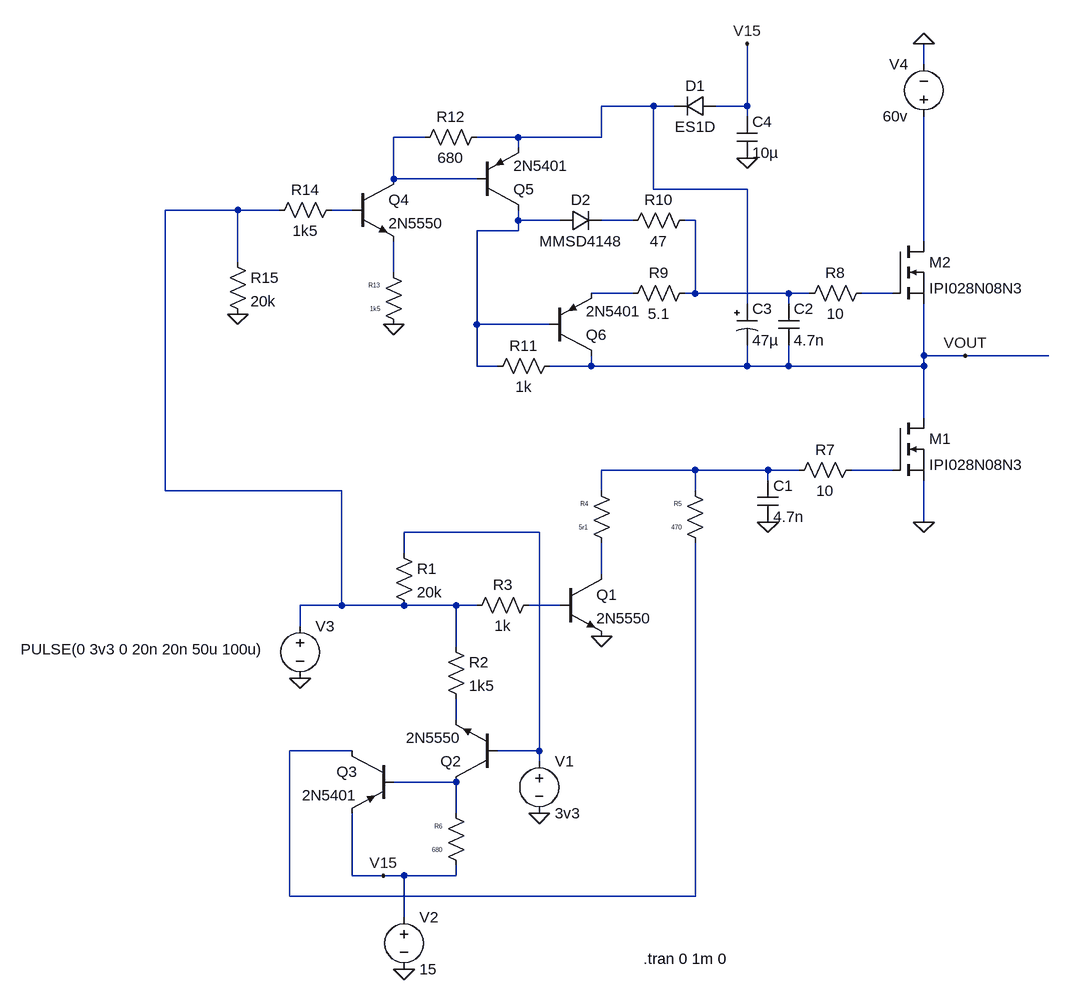
[diagram p0: schematic Motor Controller Gate Driver Linear.asc]
Motor Controller Gate Driver Linear.asc, the LTspice schematic file:
Version 4
SHEET 1 1140 832
WIRE 944 -576 944 -608
WIRE 528 -512 448 -512
WIRE 560 -512 528 -512
WIRE 672 -512 672 -608
WIRE 672 -512 624 -512
WIRE 672 -496 672 -512
WIRE 176 -464 128 -464
WIRE 320 -464 256 -464
WIRE 448 -464 448 -512
WIRE 448 -464 320 -464
WIRE 320 -448 320 -464
WIRE 128 -400 128 -464
WIRE 256 -400 128 -400
WIRE 528 -384 528 -512
WIRE 672 -384 528 -384
WIRE -112 -352 -224 -352
WIRE -48 -352 -112 -352
WIRE 64 -352 32 -352
WIRE 320 -336 320 -352
WIRE 384 -336 320 -336
WIRE 496 -336 448 -336
WIRE 592 -336 576 -336
WIRE 320 -320 320 -336
WIRE 320 -320 256 -320
WIRE 944 -304 944 -496
WIRE -112 -272 -112 -352
WIRE 128 -256 128 -304
WIRE 496 -224 432 -224
WIRE 592 -224 592 -336
WIRE 592 -224 576 -224
WIRE 736 -224 592 -224
WIRE 768 -224 736 -224
WIRE 896 -224 848 -224
WIRE 672 -208 672 -384
WIRE 736 -208 736 -224
WIRE 256 -176 256 -320
WIRE 368 -176 256 -176
WIRE 944 -128 944 -208
WIRE 1008 -128 944 -128
WIRE 1136 -128 1008 -128
WIRE 256 -112 256 -176
WIRE 288 -112 256 -112
WIRE 432 -112 432 -128
WIRE 432 -112 368 -112
WIRE 672 -112 672 -144
WIRE 672 -112 432 -112
WIRE 736 -112 736 -144
WIRE 736 -112 672 -112
WIRE 944 -112 944 -128
WIRE 944 -112 736 -112
WIRE 944 -32 944 -112
WIRE 592 48 448 48
WIRE 704 48 592 48
WIRE 752 48 704 48
WIRE 896 48 832 48
WIRE 704 64 704 48
WIRE -224 80 -224 -352
WIRE 48 80 -224 80
WIRE 448 80 448 48
WIRE 592 80 592 48
WIRE 944 128 944 64
WIRE 352 144 144 144
WIRE 144 176 144 144
WIRE 448 208 448 160
WIRE 48 256 48 80
WIRE 48 256 -16 256
WIRE 144 256 48 256
WIRE 224 256 144 256
WIRE 256 256 224 256
WIRE 384 256 336 256
WIRE -16 288 -16 256
WIRE 224 320 224 256
WIRE 224 432 224 400
WIRE 64 480 -32 480
WIRE 352 480 352 144
WIRE 352 480 288 480
WIRE 352 496 352 480
WIRE 224 528 128 528
WIRE 224 576 224 528
WIRE 64 672 64 576
WIRE 112 672 64 672
WIRE 144 672 112 672
WIRE 224 672 224 656
WIRE 224 672 144 672
WIRE -32 704 -32 480
WIRE 592 704 592 160
WIRE 592 704 -32 704
WIRE 144 736 144 672
FLAG 448 304 0
FLAG 352 576 0
FLAG 144 816 0
FLAG -16 368 0
FLAG 704 128 0
FLAG 944 128 0
FLAG 944 -608 0
FLAG -112 -192 0
FLAG 128 -176 0
FLAG 672 -432 0
FLAG 1008 -128 VOUT
FLAG 112 672 V15
FLAG 672 -608 V15
SYMBOL res 128 160 R0
SYMATTR InstName R1
SYMATTR Value 20k
SYMBOL res 208 304 R0
SYMATTR InstName R2
SYMATTR Value 1k5
SYMBOL res 352 240 R90
WINDOW 0 0 56 VBottom 2
WINDOW 3 32 56 VTop 2
SYMATTR InstName R3
SYMATTR Value 1k
SYMBOL res 464 176 R180
WINDOW 0 36 76 Left 0
WINDOW 3 36 40 Left 0
SYMATTR InstName R4
SYMATTR Value 5r1
SYMBOL res 608 176 R180
WINDOW 0 36 76 Left 0
WINDOW 3 36 40 Left 0
SYMATTR InstName R5
SYMATTR Value 470
SYMBOL res 240 672 R180
WINDOW 0 36 76 Left 0
WINDOW 3 36 40 Left 0
SYMATTR InstName R6
SYMATTR Value 680
SYMBOL npn 384 208 R0
SYMATTR InstName Q1
SYMATTR Value 2N5550
SYMBOL npn 288 528 R180
SYMATTR InstName Q2
SYMATTR Value 2N5550
SYMBOL pnp 128 480 M0
SYMATTR InstName Q3
SYMATTR Value 2N5401
SYMBOL voltage 352 480 R0
SYMATTR InstName V1
SYMATTR Value 3v3
SYMBOL voltage 144 720 R0
SYMATTR InstName V2
SYMATTR Value 15
SYMBOL voltage -16 272 R0
WINDOW 3 -430 52 Left 2
SYMATTR Value PULSE(0 3v3 0 20n 20n 50u 100u)
SYMATTR InstName V3
SYMBOL res 848 32 R90
WINDOW 0 0 56 VBottom 2
WINDOW 3 32 56 VTop 2
SYMATTR InstName R7
SYMATTR Value 10
SYMBOL cap 688 64 R0
SYMATTR InstName C1
SYMATTR Value 4.7n
SYMBOL nmos 896 -32 R0
SYMATTR InstName M1
SYMATTR Value IPI028N08N3
SYMBOL voltage 944 -480 R180
WINDOW 0 24 96 Left 2
WINDOW 3 24 16 Left 2
SYMATTR InstName V4
SYMATTR Value 60v
SYMBOL nmos 896 -304 R0
SYMATTR InstName M2
SYMATTR Value IPI028N08N3
SYMBOL res 864 -240 R90
WINDOW 0 0 56 VBottom 2
WINDOW 3 32 56 VTop 2
SYMATTR InstName R8
SYMATTR Value 10
SYMBOL res 592 -240 R90
WINDOW 0 0 56 VBottom 2
WINDOW 3 32 56 VTop 2
SYMATTR InstName R9
SYMATTR Value 5.1
SYMBOL res 592 -352 R90
WINDOW 0 0 56 VBottom 2
WINDOW 3 32 56 VTop 2
SYMATTR InstName R10
SYMATTR Value 47
SYMBOL res 384 -128 R90
WINDOW 0 0 56 VBottom 2
WINDOW 3 32 56 VTop 2
SYMATTR InstName R11
SYMATTR Value 1k
SYMBOL res 272 -480 R90
WINDOW 0 0 56 VBottom 2
WINDOW 3 32 56 VTop 2
SYMATTR InstName R12
SYMATTR Value 680
SYMBOL res 144 -160 R180
WINDOW 0 36 76 Left 0
WINDOW 3 36 40 Left 0
SYMATTR InstName R13
SYMATTR Value 1k5
SYMBOL res -64 -336 R270
WINDOW 0 32 56 VTop 2
WINDOW 3 0 56 VBottom 2
SYMATTR InstName R14
SYMATTR Value 1k5
SYMBOL res -128 -288 R0
SYMATTR InstName R15
SYMATTR Value 20k
SYMBOL cap 720 -208 R0
SYMATTR InstName C2
SYMATTR Value 4.7n
SYMBOL polcap 656 -208 R0
WINDOW 0 24 8 Left 2
WINDOW 3 24 56 Left 2
SYMATTR InstName C3
SYMATTR Value 47µ
SYMATTR Description Capacitor
SYMATTR Type cap
SYMATTR SpiceLine Rser=650m Lser=0 mfg="Nichicon" pn="UPR1J470MPH" type="Al electrolytic"
SYMBOL npn 64 -400 R0
SYMATTR InstName Q4
SYMATTR Value 2N5550
SYMBOL pnp 256 -352 M180
SYMATTR InstName Q5
SYMATTR Value 2N5401
SYMBOL pnp 368 -128 M180
SYMATTR InstName Q6
SYMATTR Value 2N5401
SYMBOL diode 624 -528 R90
WINDOW 0 0 32 VBottom 2
WINDOW 3 32 32 VTop 2
SYMATTR InstName D1
SYMATTR Value ES1D
SYMBOL cap 656 -496 R0
SYMATTR InstName C4
SYMATTR Value 10µ
SYMBOL diode 384 -320 R270
WINDOW 0 32 32 VTop 2
WINDOW 3 0 32 VBottom 2
SYMATTR InstName D2
SYMATTR Value MMSD4148
TEXT 512 800 Left 2 !.tran 0 1m 0

The netlist it stands for:
* Motor Controller Gate Driver Linear.asc
R1 N014 N003 20k
R2 N003 N017 1k5
R3 N016 N003 1k
R4 N015 N012 5r1
R5 N018 N012 470
R6 V15 N019 680
Q1 N015 N016 0 0 2N5550
Q2 N019 N014 N017 0 2N5550
Q3 N018 N019 V15 0 2N5401
V1 N014 0 3v3
V2 V15 0 15
V3 N003 0 PULSE(0 3v3 0 20n 20n 50u 100u)
R7 N013 N012 10
C1 N012 0 4.7n
M1 VOUT N013 0 0 IPI028N08N3
V4 N008 0 60v
M2 N008 N011 VOUT VOUT IPI028N08N3
R8 N011 N007 10
R9 N007 N010 5.1
R10 N007 N006 47
R11 VOUT N005 1k
R12 N001 N002 680
R13 0 N009 1k5
R14 N003 N004 1k5
R15 N003 0 20k
C2 N007 VOUT 4.7n
C3 N001 VOUT 47µ Rser=650m Lser=0 mfg="Nichicon" pn="UPR1J470MPH" type="Al electrolytic"
Q4 N002 N004 N009 0 2N5550
Q5 N005 N002 N001 0 2N5401
Q6 VOUT N005 N010 0 2N5401
D1 V15 N001 ES1D
C4 V15 0 10µ
D2 N005 N006 MMSD4148
.model D D
.lib standard.dio
.model NPN NPN
.model PNP PNP
.lib standard.bjt
.model NMOS NMOS
.model PMOS PMOS
.lib standard.mos
.tran 0 1m 0
.backanno
.end